# Altium schematic sheet USB to Serial.SchDoc
size A3
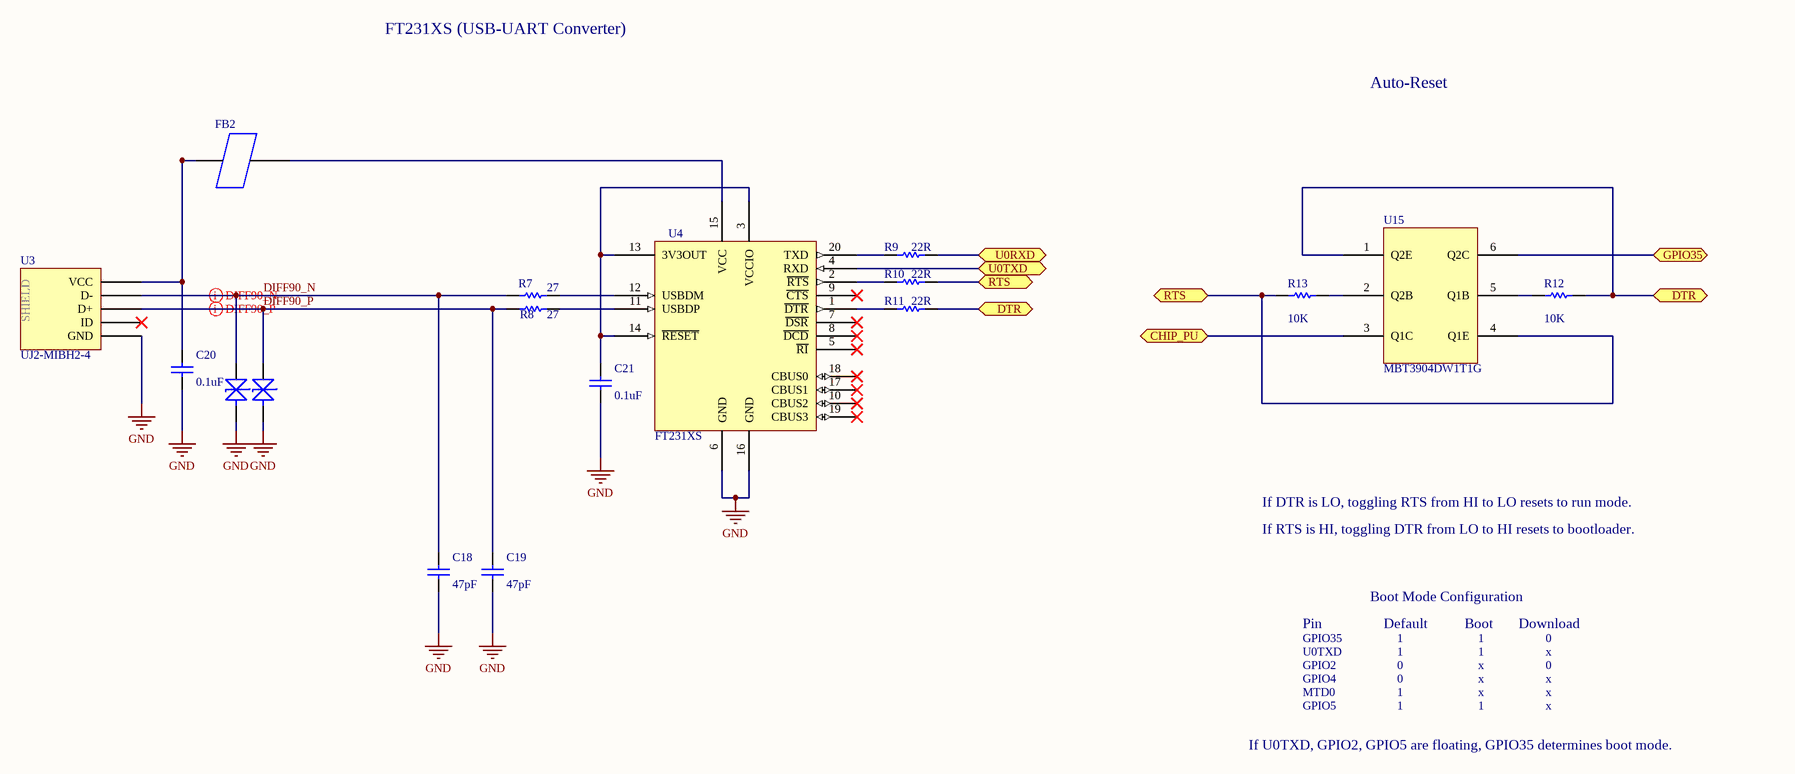
[diagram p0: USB to Serial.SchDoc]

## Parts
C18  value 47pF  [0402]  (hidden comment: Cap)
C19  value 47pF  [0402]  (hidden comment: Cap)
C20  value 0.1uF  [1608[0603]]  (hidden comment: Cap)
C21  value 0.1uF  [1608[0603]]  (hidden comment: Cap)
D2  ESD7951ST5GOSCT-ND  [SODFL100X40-2N]  (value not drawn)
D3  ESD7951ST5GOSCT-ND  [SODFL100X40-2N]  (value not drawn)
FB2  Ferrite Bead  [MI0805K400R-10]  (value not drawn)
R7  value 27  [J1-0603]  (hidden comment: Res1)
R8  value 27  [J1-0603]  (hidden comment: Res1)
R9  value 22R  [6-0805_N]  (hidden comment: Res1)
R10  value 22R  [6-0805_N]  (hidden comment: Res1)
R11  value 22R  [6-0805_N]  (hidden comment: Res1)
R12  value 10K  [6-0805_N]  (hidden comment: Res1)
R13  value 10K  [6-0805_N]  (hidden comment: Res1)
U3  UJ2-MIBH2-4  [UJ2-MIBH2-4-SMT]
U4  FT231XS  [SOP64P1030X175-20N]
U15  MBT3904DW1T1G  [SOT65P210X110-6N]

## Ports
CHIP_PU, DTR (bidir), GPIO35 (bidir), RTS (bidir), U0RXD, U0TXD

## Nets
GND: C18.1 C19.1 C20.1 C21.1 D2.1(CATHODE) D3.1(CATHODE) U3.5(GND) U4.6(GND) U4.16(GND)
CHIP_PU: U15.3(Q1C) ; port CHIP_PU
DIFF90_N: C18.2 D2.2(ANODE) R7.1 U3.2(D-)
DIFF90_P: C19.2 D3.2(ANODE) R8.1 U3.3(D+)
DTR: R11.2 R12.2 U15.1(Q2E) ; port DTR
GPIO35: U15.6(Q2C) ; port GPIO35
RTS: R10.2 R13.1 U15.4(Q1E) ; port RTS
U0RXD: R9.2 ; port U0RXD
U0TXD: U4.4(RXD) ; port U0TXD
NetC20_2: C20.2 FB2.1 U3.1(VCC)
NetC21_2: C21.2 U4.3(VCCIO) U4.13(3V3OUT) U4.14(~{RESET})
NetFB2_2: FB2.2 U4.15(VCC)
NetR7_2: R7.2 U4.12(USBDM)
NetR8_2: R8.2 U4.11(USBDP)
NetR9_1: R9.1 U4.20(TXD)
NetR10_1: R10.1 U4.2(~{RTS})
NetR11_1: R11.1 U4.1(~{DTR})
NetR12_1: R12.1 U15.5(Q1B)
NetR13_2: R13.2 U15.2(Q2B)

Not connected (* = marked no-connect by the designer): U3 4(ID)*; U4 5(~{RI})* 7(~{DSR})* 8(~{DCD})* 9(~{CTS})* 10(CBUS2)* 17(CBUS1)* 18(CBUS0)* 19(CBUS3)*

## Layout directives
differential pair: DIFF90_N, DIFF90_P

## Notes on the sheet
- FT231XS (USB-UART Converter)
- Auto-Reset
- If DTR is LO, toggling RTS from HI to LO resets to run mode.
- If RTS is HI, toggling DTR from LO to HI resets to bootloader.
- Pin
- GPIO35
- U0TXD
- Boot Mode Configuration
- Default
- 1
- Boot
- Download
- 0
- x
- GPIO2
- GPIO4
- MTD0
- GPIO5
- If U0TXD, GPIO2, GPIO5 are floating, GPIO35 determines boot mode.
- (in symbol USB Shield) SHIELD

## Library data of the parts
C18-C21 = Cap: Capacitor; Published: 8-Jun-2000; LatestRevisionDate: 17-Jul-2002; LatestRevisionNote: Re-released for DXP Platform.; PackageReference: RAD-0.3; Publisher: Altium Limited; PackageDescription: Radial Cap, Thru-Hole; 2 Leads; 0.3 in Pin Spacing
D2 D3 = ESD7951S: TVS Diode; Supplier Link: ESD7951ST5GOSCT-ND
FB2 = Ferrite Bead: MI0805K400R-10; Supplier Link: 240-2389-1-ND
R7-R13 = Res1: Resistor; Published: 8-Jun-2000; LatestRevisionDate: 17-Jul-2002; LatestRevisionNote: Re-released for DXP Platform.; PackageReference: AXIAL-0.3; Publisher: Altium Limited; PackageDescription: Axial Device, Thru-Hole; 2 Leads; 0.3 in Pin Spacing
U3 = USB Shield: Supplier Link: 102-4007-1-ND
U4 = FT231XS: USB-UART Interface; Supplier Link: 768-1129-1-ND
U15 = MBT3904DW1: Dual NPN Transistors; Supplier Link: MBT3904DW1T1GOSCT-ND